# EAGLE design Cool-S-Budget (EAGLE 9.7.0)
Assembly variants: Default
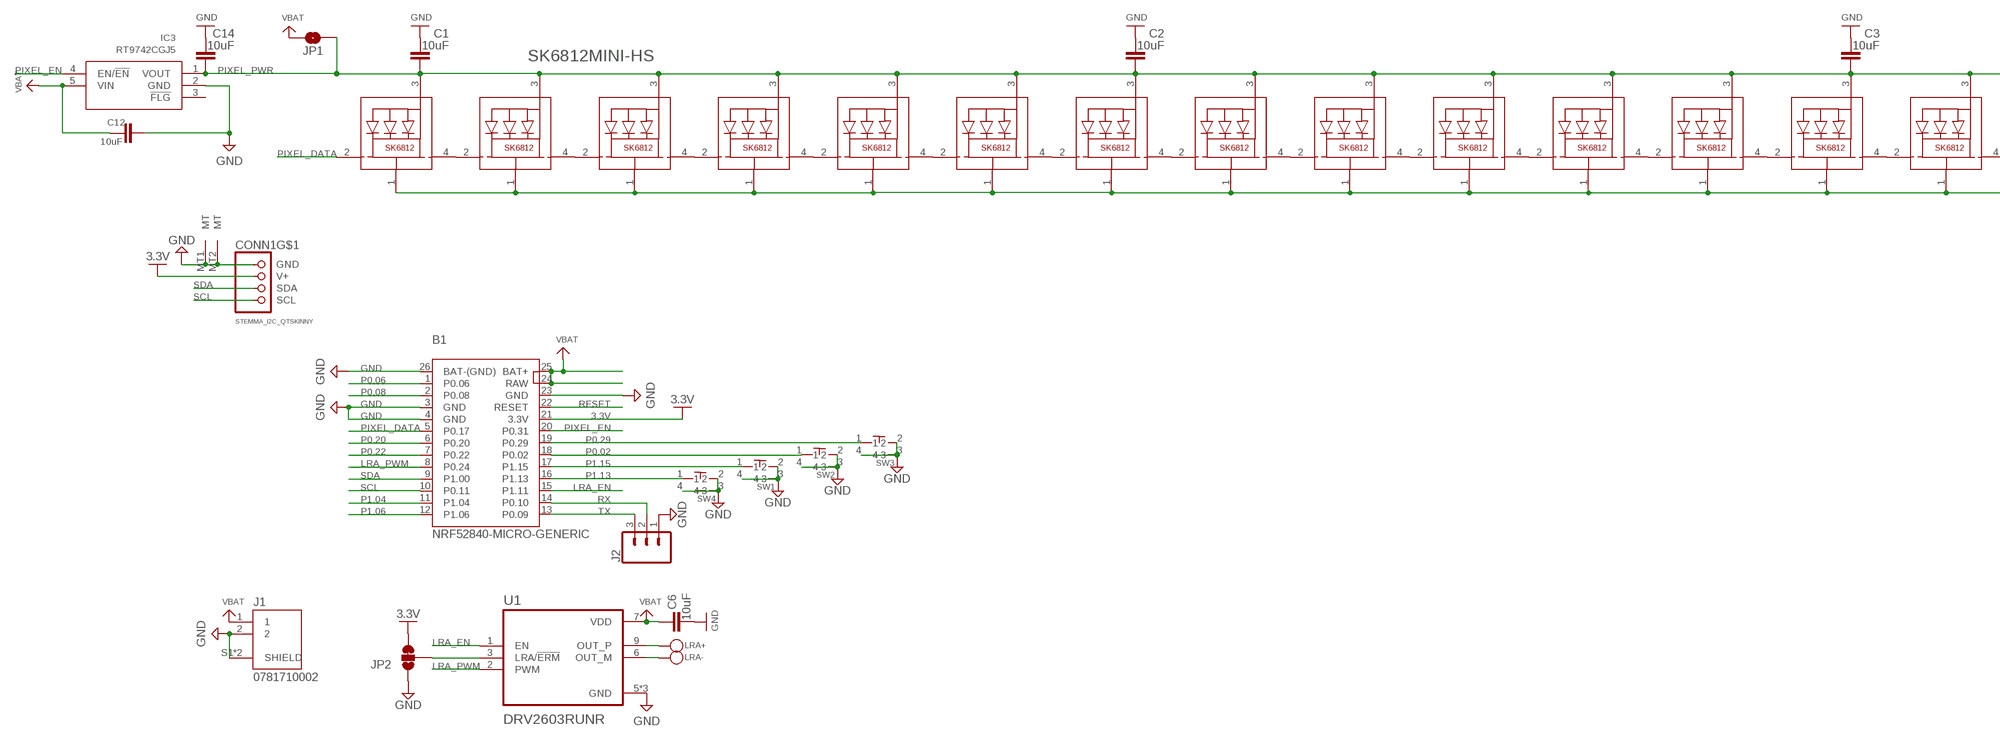
[diagram p0: schematic, sheet 1, part 1 of 2]
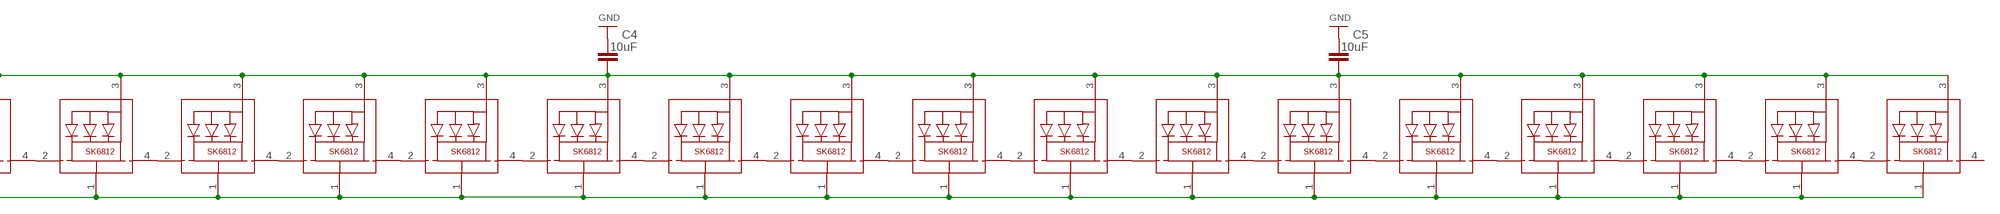
[diagram p1: schematic, sheet 1, part 2 of 2]

## Parts
B1  NRF52840-MICRO-GENERIC  [NRF52840-MICRO-GENERIC]
C1  10uF  C_CHIP-0603(1608-METRIC)  [CAPC1608X85]
C2  10uF  C_CHIP-0603(1608-METRIC)  [CAPC1608X85]
C3  10uF  C_CHIP-0603(1608-METRIC)  [CAPC1608X85]
C4  10uF  C_CHIP-0603(1608-METRIC)  [CAPC1608X85]
C5  10uF  C_CHIP-0603(1608-METRIC)  [CAPC1608X85]
C6  10uF  C_CHIP-0603(1608-METRIC)  [CAPC1608X85]
C12  10uF  C_CHIP-0603(1608-METRIC)  [CAPC1608X85]
C14  10uF  C_CHIP-0603(1608-METRIC)  [CAPC1608X85]
CONN1  STEMMA_I2C_QTSKINNY  [JST_SH4_SKINNY]
IC3  RT9742CGJ5  RT9742GGJ5  [SOT94P280X100-5N]
J1  0781710002  [MOLEX_0781710002]
J2  455-1750-1-ND  CONN_03  [1X03]
JP1  JUMPER-SMT_2_NO_NO-SILK  [SMT-JUMPER_2_NO_NO-SILK]
JP2  JUMPER-SMT_3_1-NC_TRACE_NO-SILK  [SMT-JUMPER_3_1-NC_TRACE_NO-SILK]
LRA+  TESTPOINT  [TESTPOINT_SMT]
LRA-  TESTPOINT  [TESTPOINT_SMT]
SW1  TS36CA-0.6250GF031SW-SMD_SHOU_TS36CA-0.6  [SW-SMD_SHOU_TS36CA-0.6]
SW2  TS36CA-0.6250GF031SW-SMD_SHOU_TS36CA-0.6  [SW-SMD_SHOU_TS36CA-0.6]
SW3  TS36CA-0.6250GF031SW-SMD_SHOU_TS36CA-0.6  [SW-SMD_SHOU_TS36CA-0.6]
SW4  TS36CA-0.6250GF031SW-SMD_SHOU_TS36CA-0.6  [SW-SMD_SHOU_TS36CA-0.6]
U1  DRV2603RUNR  [QFN50P200X200X80-10N]
U3  SK6812MINI  [LED3535]
U4  SK6812MINI  [LED3535]
U5  SK6812MINI  [LED3535]
U6  SK6812MINI  [LED3535]
U7  SK6812MINI  [LED3535]
U8  SK6812MINI  [LED3535]
U9  SK6812MINI  [LED3535]
U10  SK6812MINI  [LED3535]
U11  SK6812MINI  [LED3535]
U12  SK6812MINI  [LED3535]
U13  SK6812MINI  [LED3535]
U14  SK6812MINI  [LED3535]
U15  SK6812MINI  [LED3535]
U16  SK6812MINI  [LED3535]
U17  SK6812MINI  [LED3535]
U18  SK6812MINI  [LED3535]
U19  SK6812MINI  [LED3535]
U20  SK6812MINI  [LED3535]
U21  SK6812MINI  [LED3535]
U22  SK6812MINI  [LED3535]
U23  SK6812MINI  [LED3535]
U24  SK6812MINI  [LED3535]
U25  SK6812MINI  [LED3535]
U26  SK6812MINI  [LED3535]
U27  SK6812MINI  [LED3535]
U28  SK6812MINI  [LED3535]
U29  SK6812MINI  [LED3535]
U30  SK6812MINI  [LED3535]
U31  SK6812MINI  [LED3535]
U32  SK6812MINI  [LED3535]

## Nets
3.3V: B1.21(3.3V) CONN1.2(V+) JP2.3
GND: B1.3(GND) B1.4(GND) B1.23(GND) B1.26(BAT-(GND)) C1.1 C2.1 C3.1 C4.1 C5.1 C6.1 C12.2 C14.1 CONN1.1(GND) CONN1.MT1(MT) CONN1.MT2(MT) IC3.2(GND) J1.2 J1.S1(SHIELD) J1.S2(SHIELD) J2.1 JP2.1 SW1.2 SW1.3 SW1.4 SW2.2 SW2.3 SW2.4 SW3.2 SW3.3 SW3.4 SW4.2 SW4.3 SW4.4 U1.5(GND) U1.8(GND) U1.10(GND) U3.1(GND) U4.1(GND) U5.1(GND) U6.1(GND) U7.1(GND) U8.1(GND) U9.1(GND) U10.1(GND) U11.1(GND) U12.1(GND) U13.1(GND) U14.1(GND) U15.1(GND) U16.1(GND) U17.1(GND) U18.1(GND) U19.1(GND) U20.1(GND) U21.1(GND) U22.1(GND) U23.1(GND) U24.1(GND) U25.1(GND) U26.1(GND) U27.1(GND) U28.1(GND) U29.1(GND) U30.1(GND) U31.1(GND) U32.1(GND)
LRA+: LRA+.P$1 U1.9(OUT_P)
LRA-: LRA-.P$1 U1.6(OUT_M)
LRA_EN: B1.15(P1.11) U1.1(EN)
LRA_PWM: B1.8(P0.24) U1.2(PWM)
N$1: U3.2(DI) U4.4(DO)
N$2: U4.2(DI) U5.4(DO)
N$3: U5.2(DI) U6.4(DO)
N$4: U6.2(DI) U7.4(DO)
N$5: U8.2(DI) U9.4(DO)
N$6: U9.2(DI) U10.4(DO)
N$7: U11.2(DI) U12.4(DO)
N$8: U7.2(DI) U8.4(DO)
N$9: U12.2(DI) U13.4(DO)
N$10: U13.2(DI) U14.4(DO)
N$11: U14.2(DI) U15.4(DO)
N$12: U16.2(DI) U17.4(DO)
N$13: U17.2(DI) U18.4(DO)
N$14: U15.2(DI) U16.4(DO)
N$15: U10.2(DI) U11.4(DO)
N$16: U19.2(DI) U20.4(DO)
N$17: U20.2(DI) U21.4(DO)
N$18: U21.2(DI) U22.4(DO)
N$19: U22.2(DI) U23.4(DO)
N$20: U24.2(DI) U25.4(DO)
N$21: U25.2(DI) U26.4(DO)
N$22: U23.2(DI) U24.4(DO)
N$23: U27.2(DI) U28.4(DO)
N$24: U28.2(DI) U29.4(DO)
N$25: U29.2(DI) U30.4(DO)
N$26: U30.2(DI) U31.4(DO)
N$27: JP2.2 U1.3(LRA/!ERM)
N$29: U31.2(DI) U32.4(DO)
N$30: U26.2(DI) U27.4(DO)
N$31: U18.2(DI) U19.4(DO)
P0.02: B1.18(P0.02) SW2.1
P0.06: B1.1(P0.06)
P0.08: B1.2(P0.08)
P0.20: B1.6(P0.20)
P0.22: B1.7(P0.22)
P0.29: B1.19(P0.29) SW3.1
P1.04: B1.11(P1.04)
P1.06: B1.12(P1.06)
P1.13: B1.16(P1.13) SW4.1
P1.15: B1.17(P1.15) SW1.1
PIXEL_DATA: B1.5(P0.17) U32.2(DI)
PIXEL_EN: B1.20(P0.31) IC3.4(EN/!EN)
PIXEL_PWR: C1.2 C2.2 C3.2 C4.2 C5.2 C14.2 IC3.1(VOUT) JP1.1 U3.3(VDD) U4.3(VDD) U5.3(VDD) U6.3(VDD) U7.3(VDD) U8.3(VDD) U9.3(VDD) U10.3(VDD) U11.3(VDD) U12.3(VDD) U13.3(VDD) U14.3(VDD) U15.3(VDD) U16.3(VDD) U17.3(VDD) U18.3(VDD) U19.3(VDD) U20.3(VDD) U21.3(VDD) U22.3(VDD) U23.3(VDD) U24.3(VDD) U25.3(VDD) U26.3(VDD) U27.3(VDD) U28.3(VDD) U29.3(VDD) U30.3(VDD) U31.3(VDD) U32.3(VDD)
RESET: B1.22(RESET)
RX: B1.14(P0.10) J2.2
SCL: B1.10(P0.11) CONN1.4(SCL)
SDA: B1.9(P1.00) CONN1.3(SDA)
TX: B1.13(P0.09) J2.3
VBAT: B1.24(RAW) B1.25(BAT+) C6.2 C12.1 IC3.5(VIN) J1.1 JP1.2 U1.7(VDD)
Unconnected: IC3.3(!FLG) U3.4(DO)

## Notes on the sheet
- SK6812MINI-HS

## Library data of the parts
B1 = Misc:NRF52840-MICRO-GENERIC: NRF52840-MICRO-GENERIC clone of NICE!NANO
C1-C6 C12 C14 = Capacitor:C: Capacitor - Generic; CATEGORY: Capacitor
CONN1 = adafruit_electromech:STEMMA_I2C; LCSC: C2845363
IC3 = CM-Camera:RT9742GGJ5: POWER LOAD SWITCH, HIGH SIDE, TSOT-23-5; Power Load Switch Type:High Side; Input Voltage:6V; Current Limit:1.1A; On State Resistance:0.07ohm; Distribution Switch Case Style:TSOT-23; No. of Pins:5Pins; Thermal Protection:Yes; On / RoHS Compliant: Yes Source: Datasheet <https://componentsearchengine.com/Datasheets/2/RT9742GGJ5.pdf>; DESCRIPTION: POWER LOAD SWITCH, HIGH SIDE, TSOT-23-5; Power Load Switch Type:High Side; Input Voltage:6V; Current Limit:1.1A; On State Resistance:0.07ohm; Distribution Switch Case Style:TSOT-23; No. of Pins:5Pins; Thermal Protection:Yes; On / RoHS Compliant: Yes; HEIGHT: 1mm; MANUFACTURER_NAME: RICHTEK; MANUFACTURER_PART_NUMBER: RT9742GGJ5; MOUSER_PART_NUMBER: 835-RT9742GGJ5; MOUSER_PRICE-STOCK: https://www.mouser.co.uk/ProductDetail/Richtek/RT9742GGJ5?qs=amGC7iS6iy%2FZU2tAnLZxIA%3D%3D
J1 = Misc:0781710002; MANUFACTURER: MOLEX; PARTREV: G; STANDARD: Manufacturer Recommendations
J2 = SparkFun-Connectors:CONN_03: Multi connection point. Often used as Generic Header-pin footprint for 0.1 inch spaced/style header connections On any of the 0.1 inch spaced packages, you can populate with these: Break Away Headers - Straight <https://www.sparkfun.com/products/116> (PRT-00116) Break Away Male Headers - Right Angle <https://www.sparkfun.com/products/553> (PRT-00553) Female Headers <https://www.sparkfun.com/products/115> (PRT-00115) Break Away Headers - Machine Pin <https://www.sparkfun.com/products/117> (PRT-00117) Break Away Female Headers - Swiss Machine Pin <https://www.sparkfun.com/products/743> (PRT-00743) Stackable Header - 3 Pin (Female, 0.1") <https://www.sparkfun.com/products/13875> (PRT-13875) For SCREWTERMINALS and SPRING TERMINALS visit here: Screw Terimnals on SparkFun.com <https://www.sparkfun.com/search/results?term=Screw+Terminals> (5mm/3.5mm/2.54mm spacing) This device is also useful as a general connection point to wire up your design to another part of your project. Our various solder wires solder well into these plated through hole pads. Hook-Up Wire - Assortment (Stranded, 22 AWG) <https://www.sparkfun.com/products/11375> (PRT-11375) Hook-Up Wire - Assortment (Solid Core, 22 AWG) <https://www.sparkfun.com/products/11367> (PRT-11367) View the entire wire category on our website here <https://www.sparkfun.com/categories/141> Special notes: Molex polarized connector foot print use with SKU : PRT-08232 with associated crimp pins and housings.; PROD_ID: XXX-00000
JP1 = SparkFun-Jumpers:JUMPER-SMT_2_NO: Normally open jumper This jumper has two pads in close proximity to each other. Apply solder to close the connection. Round pads are easier to solder for beginners, but are a lot larger. SparkFun Product that uses the round pads: SparkFun EL Sequencer <https://www.sparkfun.com/products/12781>
JP2 = SparkFun-Jumpers:JUMPER-SMT_3_1-NC_TRACE: Normally closed trace jumper (1 of 2 connections) This jumper has a trace between two pads so it's normally closed (NC). The other connection is normally open (NO). Use a razor knife to open the connection. For best results follow the IPC guidelines for cutting traces: Cutout at least 0.063 mm (0.005 in). Remove all loose material to clean up the cut area. Seal the cut with an approved epoxy. Reapply solder to reclose the connection, or to close the NO connection.
LRA+ LRA- = microbuilder:TESTPOINT: Test Point Various test points for characterisation and PCB testing TESTPOINT_SMT - Compact Surface Mount Test Point [Digikey: 5016KTR-ND]
SW1-SW4 = ts36ca-0.6250gf031:TS36CA-0.6250GF031; LCSC: C2906288
U1 = Misc:DRV2603RUNR; AVAILABILITY: Good; DESCRIPTION: IC LRA/ERM HAPTIC DRIVER 10QFN; MF: Texas Instruments; MP: DRV2603RUNR; PACKAGE: QFN-10 Texas Instruments; PARTREV: C; PRICE: 1.02 USD; STANDARD: IPC-7351B
U3-U32 = microbuilder:SK6812MINI: SK6812MINI - RGB Smart LED VDD: 5.2V Iout: ~50mA FPWM: 1.2kHz

## Board
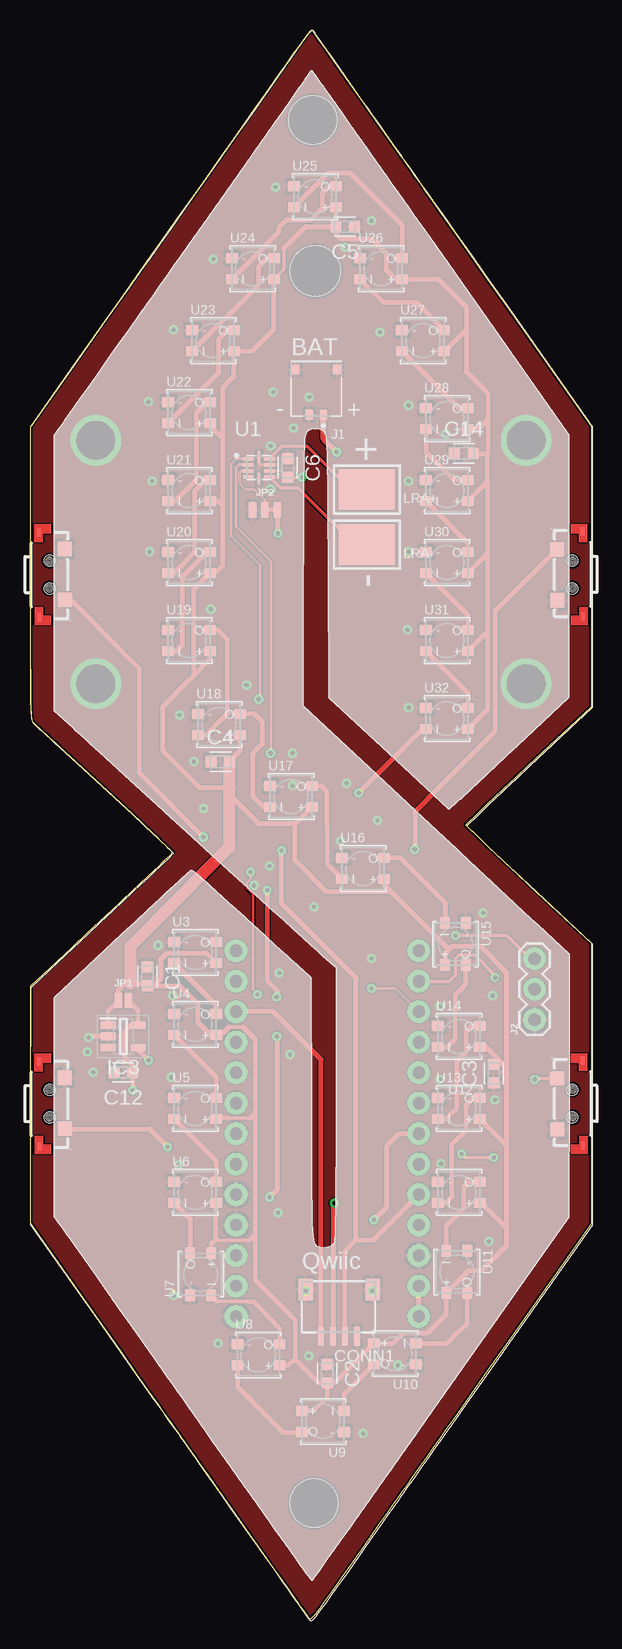
[diagram p2: board, top side]
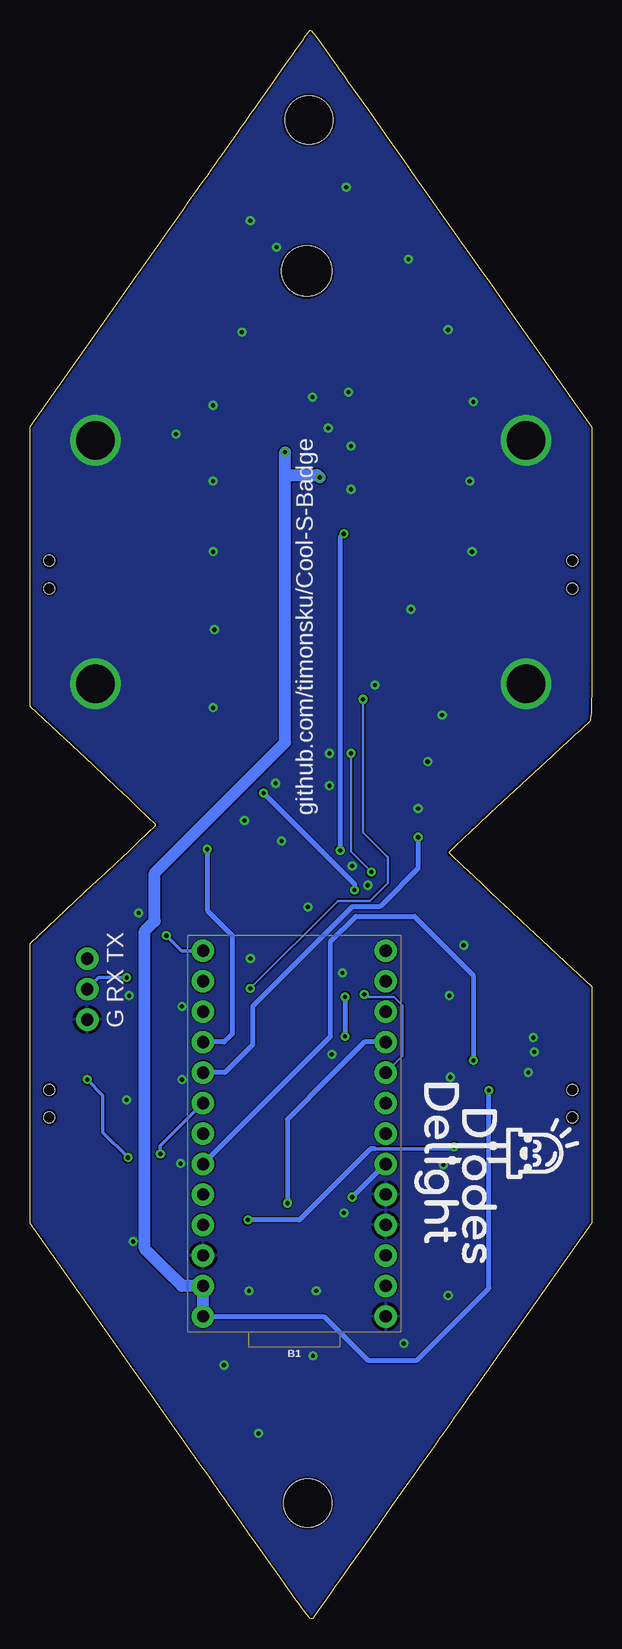
[diagram p3: board, bottom side, seen from below]

Size 46.86 x 132.42 mm. Coordinates in mm from the lower left corner, seen from the top.
Outline: 22.38,131.03 22.25,130.84 22.08,130.6 21.87,130.3 21.62,129.95 21.34,129.55 21.03,129.11 20.69,128.64 20.33,128.12 19.54,127.01 18.69,125.8 16.89,123.23 15.72,121.59 14.63,120.04 13.6,118.58 12.62,117.2 11.7,115.9 10.83,114.66 10,113.48 9.2,112.35 8.43,111.26 7.69,110.2 6.25,108.16 3.41,104.15 0,99.31 0,87.1 0,86 0,84.97 0,84.01 0,83.11 0,82.27 0,81.49 0,80.76 0,80.09 0.01,79.48 0.01,78.91 0.01,78.39 0.01,77.92 0.02,77.49 0.02,77.1 0.03,76.44 0.05,75.92 0.07,75.51 0.09,75.22 0.11,75.01 0.14,74.87 0.18,74.77 0.27,74.68 0.38,74.58 0.54,74.43 0.76,74.24 1.02,74 1.32,73.73 1.67,73.41 2.05,73.07 2.46,72.69 3.36,71.86 4.34,70.96 6.42,69.03 7.46,68.06 8.46,67.13 9.39,66.26 10.22,65.49 10.58,65.14 10.91,64.83 11.2,64.56 11.45,64.33 11.64,64.14 11.79,64 11.88,63.91 11.91,63.87 11.88,63.83 11.78,63.73 11.63,63.58 11.41,63.37 11.12,63.09 10.76,62.75 10.32,62.33 9.8,61.84 9.19,61.27 8.49,60.61 7.7,59.87 6.82,59.04 5.83,58.12 4.74,57.1 3.54,55.98 2.23,54.75 0.01,52.68 0,42.83 0,32.98 5.47,25.24 7.71,22.06 8.78,20.54 9.78,19.13 10.24,18.47 10.68,17.86 11.08,17.29 11.45,16.77 11.77,16.31 12.06,15.91 12.29,15.57 12.48,15.31 12.66,15.05 12.88,14.74 13.14,14.37 13.43,13.95 13.76,13.49 14.11,12.99 14.89,11.89 15.75,10.68 16.65,9.39 18.52,6.75 19.43,5.46 20.28,4.25 21.06,3.14 21.42,2.63 21.76,2.16 22.06,1.73 22.34,1.34 22.58,0.99 22.79,0.7 22.96,0.46 23.1,0.27 23.19,0.15 23.23,0.08 23.31,0 23.42,0 23.49,0.04 23.58,0.12 23.69,0.24 23.84,0.41 24.01,0.64 24.23,0.92 24.48,1.27 24.79,1.69 25.14,2.19 25.55,2.77 26.03,3.44 26.56,4.2 27.88,6.07 28.53,7 29.16,7.9 29.75,8.73 30.28,9.48 30.73,10.11 30.92,10.37 31.08,10.6 31.26,10.85 31.51,11.21 31.82,11.65 32.19,12.18 32.62,12.78 33.09,13.46 33.62,14.2 34.18,15 34.79,15.85 35.42,16.75 36.09,17.69 36.77,18.66 38.21,20.68 39.68,22.77 46.86,32.95 46.86,44.62 46.86,56.29 41.62,61.17 40.56,62.16 39.58,63.08 38.69,63.91 38.29,64.3 37.92,64.65 37.58,64.97 37.27,65.26 37.01,65.51 36.79,65.73 36.61,65.9 36.48,66.03 36.4,66.12 36.37,66.15 36.4,66.19 36.48,66.27 36.61,66.4 36.79,66.58 37.01,66.79 37.27,67.04 37.57,67.33 37.91,67.66 38.28,68.01 38.68,68.39 39.57,69.23 40.55,70.16 41.6,71.14 46.85,76.04 46.85,87.7 46.86,99.35 39.68,109.54 38.2,111.63 36.76,113.66 35.4,115.59 34.76,116.5 34.15,117.37 33.57,118.18 33.04,118.94 32.55,119.63 32.11,120.25 31.72,120.8 31.39,121.26 31.13,121.63 30.93,121.91 30.26,122.86 29.57,123.85 29.24,124.31 28.94,124.74 28.67,125.11 28.45,125.43 28.14,125.86 27.81,126.34 27.05,127.42 25.45,129.69 25.07,130.23 24.71,130.73 24.39,131.19 24.11,131.59 23.87,131.92 23.69,132.18 23.56,132.35 23.51,132.42 23.47,132.41 23.4,132.34 23.29,132.22 23.15,132.05 22.79,131.59 22.38,131.03
Copper layers (1*16): Top 0.035mm / dielectric 1.5mm / Bottom 0.035mm
Design rules "JLC-2-Layer.edru *": minimum track width 0.1mm, minimum drill 0.35mm, track to track 0.1mm, track to pad 0.1mm, pad to pad 0.1mm, via to via 6mil, smd to smd 0.1mm, copper to edge 0.2mm, drill to drill 6mil, minimum pad ring 10mil, minimum via ring 8mil, stop-mask expansion 0mil, vias tented up to drill 0.5mm, thermal gap 10mil
Holes 4.2 mm at 23.79,112.33
Holes 4 mm at 23.59,124.93 23.69,9.63
bKeepout: area 12.2,57.7 to 36,109.6

### Footprints (pad centres in the part's own frame; a part is rotated, then mirrored left to right if it is on the bottom)
NRF52840-MICRO-GENERIC = drill 1.016 pad 1.88: 1 -7.62,12.7; 2 -7.62,10.16; 3 -7.62,7.62; 4 -7.62,5.08; 5 -7.62,2.54; 6 -7.62,0; 7 -7.62,-2.54; 8 -7.62,-5.08; 9 -7.62,-7.62; 10 -7.62,-10.16; 11 -7.62,-12.7; 12 -7.62,-15.24; 13 7.62,-15.24; 14 7.62,-12.7; 15 7.62,-10.16; 16 7.62,-7.62; 17 7.62,-5.08; 18 7.62,-2.54; 19 7.62,0; 20 7.62,2.54; 21 7.62,5.08; 22 7.62,7.62; 23 7.62,10.16; 24 7.62,12.7; 25 7.62,15.24; 26 -7.62,15.24
CAPC1608X85 = smd 0.921 x 0.97: 1 -0.775,0; 2 0.775,0
JST_SH4_SKINNY = smd 0.5 x 1.55: 1 -1.5,2; 2 -0.5,2; 3 0.5,2; 4 1.5,2 | smd 1.2 x 1.8: MT1 -2.8,-1.9; MT2 2.8,-1.9
SOT94P280X100-5N = smd 1.25 x 0.65: 1 -1.25,0.94; 2 -1.25,0; 3 -1.25,-0.94; 4 1.25,-0.94; 5 1.25,0.94
MOLEX_0781710002 = smd 0.6 x 0.85: 1 -0.6,3.775; 2 0.6,3.775 | smd 0.7 x 0.8: S1 -1.75,0; S2 1.75,0
1X03 = drill 1.016 pad 1.88: 1 0,0; 2 2.54,0; 3 5.08,0
SMT-JUMPER_2_NO_NO-SILK = smd 0.635 x 1.27: 1 -0.406,0; 2 0.406,0
SMT-JUMPER_3_1-NC_TRACE_NO-SILK = smd 0.66 x 1.27: 1 -1.041,0; 2 0,0; 3 1.041,0
TESTPOINT_SMT = smd 4.7 x 3.4: P$1 0,0
SW-SMD_SHOU_TS36CA-0.6 = smd 1.2 x 1.2: 1 2.1,0.94; 2 -2.15,0.91 | smd 0.61 x 0.305: 3 -3.5,-1.24; 4 3.6,-1.21 | hole 0.9: -1.15,-0.36; 1.15,-0.36
QFN50P200X200X80-10N = smd 0.96 x 0.27: 1 -0.885,0.75; 2 -0.885,0.25; 3 -0.885,-0.25; 4 -0.885,-0.75; 6 0.885,-0.75; 7 0.885,-0.25; 8 0.885,0.25; 9 0.885,0.75 | smd 0.27 x 0.96: 5 0,-0.885; 10 0,0.885
LED3535 = smd 1 x 0.85: 1 -1.75,0.875; 2 -1.75,-0.875; 3 1.75,-0.875; 4 1.75,0.875

### Placement (x,y rotation side)
B1  24.81,40.43 180 bottom
C1  9.79,53.53 270 top
C2  24.79,20.43 270 top
C3  38.69,45.43 90 top
C4  15.89,71.43 0 top
C5  26.29,116.03 180 top
C6  21.49,95.93 270 top
C12  7.79,45.53 180 top
C14  36.19,97.13 0 top
CONN1  25.79,25.53 180 top
IC3  7.79,48.53 0 top
J1  23.89,104.13 180 top
J2  42.09,49.93 90 top
JP1  7.79,51.53 0 top
JP2  19.59,92.43 0 top
LRA+  28.09,94.13 0 top
LRA-  28.09,89.53 0 top
SW1  1.99,87.03 270 top
SW2  44.89,42.93 90 top
SW3  1.99,42.93 270 top
SW4  44.89,87.03 90 top
U1  19.09,95.93 0 top
U3  13.79,55.53 0 top
U4  13.79,49.53 0 top
U5  13.79,42.53 0 top
U6  13.79,35.53 0 top
U7  14.24,28.7 90 top
U8  19.05,21.98 0 top
U9  24.45,16.43 180 top
U10  30.45,22.08 180 top
U11  35.61,28.89 270 top
U12  35.79,35.53 0 top
U13  35.79,42.53 0 top
U14  35.79,48.53 0 top
U15  35.49,56.23 270 top
U16  27.79,62.53 0 top
U17  21.79,68.53 0 top
U18  15.79,74.53 0 top
U19  13.29,81.53 0 top
U20  13.29,88.03 0 top
U21  13.29,94.03 0 top
U22  13.29,100.53 0 top
U23  15.29,106.53 0 top
U24  18.59,112.53 0 top
U25  23.79,118.53 0 top
U26  29.29,112.53 0 top
U27  32.79,106.53 0 top
U28  34.79,100.03 0 top
U29  34.79,94.03 0 top
U30  34.79,88.03 0 top
U31  34.79,81.53 0 top
U32  34.79,75.03 0 top
U$4  [DIODES-DELIGHT-LOGO-15X15]  14.79,44.63 270 bottom

### Tracks (layer width: path | path; a pad name or v marks a point on that pad's centre or on a via)
3.3V  (via drill 0.35)
  Top 0.4: B1.21 28.63,31.55 27.21,31.55 | CONN1.2 26.29,30.26 26.28,30.27 26.28,30.62 27.21,31.55 | 27.21,31.55 27.21,53.41 22.29,58.33 20.99,59.63 v20.99,64.03 | v20.69,90.43 20.69,92.37 JP2.3
  Bottom 0.4: v20.99,64.03 20.99,90.13 v20.69,90.43
GND  (via drill 0.35 pad 0.5, 3.2)
  Top 0.2: U1.8 19.14,96.18 19.09,96.23 U1.10
  Top 0.4: IC3.2 4.99,48.53 v4.89,48.43
  other vias: 31.59,75.93 31.49,82.43 31.59,88.93 31.59,94.83 31.59,101.13 29.19,107.23 26.29,114.33 28.49,116.53 15.29,113.33 11.99,107.43 9.89,101.43 20.29,102.23 23.29,101.83 21.99,99.23 10.19,94.83 9.99,88.93 15.09,84.13 13.69,71.43 21.89,69.43 25.89,64.83 37.79,58.83 23.69,59.33 12.49,75.33 34.69,98.73 34.19,51.03 34.19,44.93 34.29,37.93 30.69,21.13 15.69,22.93 27.79,15.43 11.99,26.93 12.39,37.83 11.79,45.13 11.89,51.93 10.69,56.13 4.79,47.23 5.29,45.53 20.49,119.33 38.79,43.23 18.69,61.13 26.39,69.63 23.26,21.9 20.09,97.73 20.09,94.13 41.39,77.93 41.39,98.23 5.49,77.93 5.49,98.23 20.69,33.83 20.79,53.83 21.69,47.03 19.99,62.73 28.49,55.03 38.59,51.93 28.99,66.53 14.49,67.53 18.09,77.83 21.89,72.13 38.26,31.43 22.99,27.33 28.59,27.33
  pour Top: -11.16,-4.42 51.74,-4.42 51.74,136.48 -11.16,136.48
  pour Bottom: -16.16,-10.42 54.74,-10.42 54.74,138.48 -16.16,138.48
LRA+
  Top 0.3: U1.9 21.02,97.73 21.89,97.73 23.09,97.73 25.39,95.43 26.69,94.13 LRA+.P$1
LRA-
  Top 0.3: LRA-.P$1 27.09,89.53 23.29,93.33 22.39,94.23 20.89,94.23 19.97,95.14 U1.6
LRA_EN  (via drill 0.35)
  Top 0.2: U1.1 17.24,96.68 16.79,96.23 16.79,90.23 19.19,87.83 19.19,76.73 v19.09,76.63 | v28.49,52.53 30.49,52.53 B1.15
  Bottom 0.2: v19.09,76.63 19.09,65.53 17.09,63.53 16.99,63.43 16.99,61.33 18.49,59.83 20.49,59.83 21.19,59.83 v28.49,52.53
LRA_PWM  (via drill 0.35)
  Top 0.2: U1.2 17.44,96.18 17.19,95.93 17.19,91.03 19.19,89.03 20.09,88.13 v20.09,72.13 | v18.99,52.03 18.59,52.43 18.59,60.41 18.11,60.89 18.11,61.37 18.39,61.65 v18.39,62.23
  Bottom 0.2: v20.09,72.13 20.09,63.93 v18.39,62.23 | v18.99,52.03 18.79,51.83 16.49,51.83 15.79,51.13 15.79,46.91 B1.8
N$1
  Top 0.4: U3.2 15.54,51.15 U4.4
N$2
  Top 0.4: U4.2 15.54,45.15 U5.4
N$3
  Top 0.4: U5.2 15.54,38.15 U6.4
N$4
  Top 0.4: U6.2 13.36,33.33 U7.4
N$5
  Top 0.4: U8.2 17.3,19.32 21.09,15.53 22.67,15.53 U9.4
N$6
  Top 0.4: U9.2 26.2,18.7 U10.4
N$7
  Top 0.4: U11.2 34.73,32.77 35.79,33.83 36.19,34.23 36.19,35.93 36.66,36.4 U12.4
N$8
  Top 0.3: 18.19,26.43 18.16,26.46 15.6,26.46
  Top 0.4: U7.2 15.6,26.46 | 18.19,26.43 18.59,26.43 20.39,24.63 20.8,24.22 U8.4
N$9
  Top 0.4: U12.2 34.71,34.65 35.21,35.15 35.21,39.55 36.39,40.73 36.39,42.83 36.96,43.4 U13.4
N$10
  Top 0.4: U13.2 34.71,41.65 35.29,42.23 35.59,42.53 35.59,46.13 35.59,46.43 36.29,47.13 36.39,47.23 36.39,48.93 36.86,49.4 U14.4
N$11
  Top 0.4: U14.2 34.81,47.65 35.49,48.33 35.49,52.03 36.09,52.63 36.36,52.9 U15.4
N$12
  Top 0.4: U16.2 24.79,62.9 24.79,66.13 24.79,68.93 24.39,69.33 24.31,69.4 U17.4
N$13
  Top 0.4: U17.2 19.46,67.65 18.59,68.53 18.59,72.13 19.29,72.83 19.39,72.93 19.39,74.73 18.71,75.4 U18.4
N$14
  Top 0.4: U15.2 34.61,59.7 30.99,63.33 30.91,63.4 U16.4
N$15
  Top 0.4: U10.2 34.81,22.95 35.79,23.93 36.48,24.62 U11.4
N$16
  Top 0.4: U19.2 12.21,80.65 12.69,81.13 12.69,86.83 14.76,88.9 U20.4
N$17
  Top 0.4: U20.2 12.01,87.15 12.89,88.03 13.79,88.93 13.79,94.03 14.66,94.9 U21.4
N$18
  Top 0.4: U21.2 12.11,93.15 12.69,93.73 13.89,94.93 13.89,100.53 14.76,101.4 U22.4
N$19
  Top 0.4: U22.2 15.79,103.9 15.79,106.73 16.46,107.4 U23.4
N$20
  Top 0.4: U24.2 20.79,115.6 20.79,116.03 21.39,116.63 22.79,116.63 23.49,116.63 24.29,117.43 24.39,117.53 24.39,118.83 24.96,119.4 U25.4
N$21
  Top 0.4: U25.2 24.91,120.53 26.69,120.53 31.04,116.18 U26.4
N$22
  Top 0.4: U23.2 19.09,111.2 19.09,112.73 19.76,113.4 U24.4
N$23
  Top 0.4: U27.2 35.79,100.9 U28.4
N$24
  Top 0.4: U28.2 33.04,97.25 35.39,94.9 U29.4
N$25
  Top 0.4: U29.2 36.54,89.65 U30.4
N$26
  Top 0.4: U30.2 36.54,83.65 U31.4
N$27
  Top 0.2: JP2.2 19.59,93.23 18.69,94.13 17.99,94.13 17.49,94.63 17.49,94.83 17.49,95.53 17.59,95.63 17.64,95.68 U1.3
N$29
  Top 0.4: U31.2 36.54,77.15 U32.4
N$30
  Top 0.4: U26.2 29.46,109.73 31.59,109.73 32.21,109.73 U27.4
N$31
  Top 0.4: U18.2 14.71,73.65 15.99,74.93 16.49,75.43 16.49,81.63 15.71,82.4 U19.4
P0.02  (via drill 0.35)
  Top 0.3: SW2.1 42.19,45.03 v42.09,44.93 | v38.69,38.43 36.29,38.43 v35.99,38.73
  Bottom 0.3: v42.09,44.93 40.79,43.63 40.79,40.53 v38.69,38.43 | v35.99,38.73 35.99,39.41 B1.18
P0.29  (via drill 0.35)
  Top 0.4: SW3.1 9.99,40.83 v11.49,39.33 | v28.69,33.23 29.79,34.33 29.79,39.43 30.79,40.43 B1.19
  Bottom 0.3: 11.65,39.17 18.12,39.17
  Bottom 0.4: v11.49,39.33 11.65,39.17 | 18.12,39.17 18.45,39.17 24.39,33.23 v28.69,33.23
P1.13  (via drill 0.35)
  Top 0.4: SW4.1 38.79,83.97 38.79,76.73 38.79,73.93 34.29,69.43 32.09,67.23 v32.09,64.13
  Bottom 0.4: v32.09,64.13 32.09,59.03 29.99,56.93 29.99,48.73 30.19,48.53 30.67,48.05 B1.16
P1.15  (via drill 0.35)
  Top 0.4: SW1.1 3.39,84.93 7.69,80.63 9.09,79.23 9.09,74.83 9.09,70.53 v14.49,65.13
  Bottom 0.4: v14.49,65.13 14.49,62.53 17.39,59.63 17.69,59.33 19.99,59.33 28.29,51.03 28.29,49.73 28.29,47.83 30.49,45.63 30.61,45.51 B1.17
PIXEL_DATA  (via drill 0.35)
  Top 0.4: v19.79,60.73 19.79,53.19 19.99,52.99 20.59,52.39 v20.59,51.83 | v27.39,68.83 31.69,73.13 32.71,74.15 U32.2 | v20.59,48.53 20.59,35.73 v19.99,35.13
  Bottom 0.4: v19.79,60.73 19.79,61.23 v27.39,68.83 | v19.99,35.13 17.23,37.89 B1.5 | v20.59,51.83 v20.59,48.53
PIXEL_EN  (via drill 0.35)
  Top 0.4: v9.89,46.53 9.04,47.38 IC3.4
  Bottom 0.4: B1.20 21.79,48.53 21.79,56.43 19.69,58.53 14.79,58.53 9.89,53.63 v9.89,46.53
PIXEL_PWR
  Top 0.3: 16.59,49.33 17.79,49.33 | 18.39,41.73 16.49,41.73 | 18.29,31.53 15.39,31.53 | U24.3 21.19,112.5 21.19,112.93 21.19,114.23
  Top 0.4: IC3.1 6.54,50.68 JP1.1 7.38,52.42 7.89,52.93 8.39,52.93 9.61,52.93 C1.2 | U18.3 17.54,72.3 C4.2 16.66,69.23 | U17.3 22.11,66.23 22.09,66.23 | 22.09,66.23 19.89,66.23 19.09,66.23 17.39,67.93 16.66,68.65 16.66,69.23 | U3.3 14.76,55.43 11.59,55.43 11.39,55.43 10.99,55.03 10.89,54.93 10.89,53.33 10.31,52.75 C1.2 | C1.2 12.46,52.75 12.89,52.33 13.99,51.23 13.99,49.73 15.06,48.65 U4.3 15.91,48.65 16.39,49.13 16.59,49.33 | 17.79,49.33 18.79,48.33 18.79,42.13 | 18.79,42.13 18.39,41.73 | 16.49,41.73 15.61,41.73 U5.3 | 18.79,42.13 18.79,32.03 | 18.79,32.03 18.39,31.63 18.29,31.53 | U7.3 15.11,31.25 15.39,31.53 15.54,31.68 U6.3 | 18.79,32.03 18.79,28.23 21.79,25.23 22.09,24.93 22.09,21.63 | 22.09,21.63 21.56,21.1 U8.3 | 22.09,21.63 24.06,19.65 C2.2 | C2.2 25.41,19.65 28.7,22.94 U10.3 30.31,22.95 30.79,23.43 31.19,23.83 33.19,23.83 34.73,25.37 U11.3 36.62,29.03 37.69,29.03 39.79,31.13 39.79,32.53 | 39.79,32.53 37.66,34.65 U12.3 | 39.79,32.53 39.79,39.4 | U13.3 39.79,39.4 | 39.79,39.4 39.79,45.4 39.79,45.9 | 39.79,45.9 38.04,47.65 U14.3 | 39.79,45.9 39.79,46.43 | 39.79,46.43 39.79,53.83 37.59,56.03 35.19,56.03 34.94,55.78 | 34.94,55.78 34.69,55.53 34.61,55.45 U15.3 | 34.94,55.78 31.69,59.03 31.44,59.28 30.14,60.58 | 39.79,46.43 39.56,46.2 C3.2 | 30.14,60.58 29.54,61.18 U16.3 | 30.14,60.58 24.74,60.58 22.09,63.23 22.09,66.23 | 16.66,69.23 14.19,69.23 12.19,71.23 11.09,72.33 11.09,76.03 13.29,78.23 13.69,78.63 | 13.69,78.63 15.04,79.98 U19.3 | 13.69,78.63 13.69,85.8 U20.3 15.41,87.15 16.09,87.83 16.09,92.73 | 16.09,92.73 15.79,93.03 15.66,93.15 U21.3 | 16.09,92.73 16.09,98.3 | 16.09,98.3 15.04,99.35 U22.3
  Top 0.4: 16.09,98.3 16.09,102.63 16.89,103.43 17.04,103.58 U23.3 18.51,105.65 19.39,106.53 20.34,107.48 U24.3 | 21.19,114.23 22.29,115.33 22.99,116.03 C5.2 | C5.2 25.51,117.63 U25.3 | C5.2 25.51,115.4 25.89,115.03 27.79,115.03 28.49,115.03 29.29,114.23 29.69,113.83 29.69,112.43 30.46,111.65 U26.3 34.06,111.65 35.19,110.53 36.39,109.33 36.39,107.43 | 36.39,107.43 34.61,105.65 U27.3 | 36.39,107.43 36.39,103.93 38.09,102.23 38.19,102.13 38.19,99.93 | 38.19,99.93 37.41,99.15 U28.3 | 38.19,99.93 38.19,97.15 | 38.19,97.15 38.19,97.13 C14.2 | 38.15,94.76 38.15,96.28 38.15,97.11 38.19,97.15 | 38.15,94.76 U29.3 | 38.15,94.76 38.15,88.76 | 38.15,88.76 U30.3 | 38.15,88.76 38.15,82.26 | 38.15,82.26 U31.3 | 38.15,82.26 38.15,75.76 U32.3 | C2.2 24.79,18.43 24.49,18.13 23.66,17.3 U9.3
  Top 1: 8.39,52.93 8.39,56.03 10.39,58.03 16.66,64.3 16.66,69.23 C4.2
RX  (via drill 0.35)
  Top 0.3: B1.14 34.99,53.13 35.29,53.43 35.49,53.63 35.49,55.03 35.79,55.33 37.09,55.33 38.79,53.63 v38.79,53.43
  Bottom 0.3: v38.79,53.43 41.13,53.43 J2.2
SCL
  Top 0.4: CONN1.4 24.29,46.63 20.29,50.63 17.23,50.63 B1.10
SDA  (via drill 0.35)
  Top 0.4: v25.39,34.63 25.29,34.53 CONN1.3
  Bottom 0.4: B1.9 18.97,48.05 21.79,45.23 25.39,41.63 v25.39,34.63
TX  (via drill 0.35)
  Top 0.3: v35.49,56.93 39.79,56.93 40.29,56.43 41.71,55.01 J2.3
  Bottom 0.3: B1.13 34.23,55.67 v35.49,56.93
VBAT  (via drill 0.35, 0.35 pad 0.5)
  Top 0.2: U1.7 20.96,95.68 21.45,95.19 C6.2
  Top 0.3: v22.69,95.13 21.51,95.13 21.45,95.19
  Top 0.4: B1.25 B1.24 | v8.59,44.03 8.59,45.5 C12.1 8.56,46.15 7.89,46.83 7.89,48.93 8.19,49.23 8.43,49.47 IC3.5 9.04,50.68 JP1.2
  Top 0.5: v25.59,97.23 24.49,98.33 J1.1
  Bottom 0.4: B1.25 22.35,25.19 18.69,21.53 14.59,21.53 10.29,25.83 8.59,27.53 v8.59,44.03
  Bottom 1: B1.25 B1.24 34.19,27.73 35.49,29.03 37.29,30.83 37.29,57.31 36.46,58.13 36.46,62.15 25.59,73.03 25.59,95.33 | 25.59,95.33 v25.59,97.23 | 25.59,95.33 22.89,95.33 v22.69,95.13

### Text on the board
tPlace: BAT | - | + | + | - | Qwiic
bPlace: github.com/timonsku/Cool-S-Badge | G RX TX